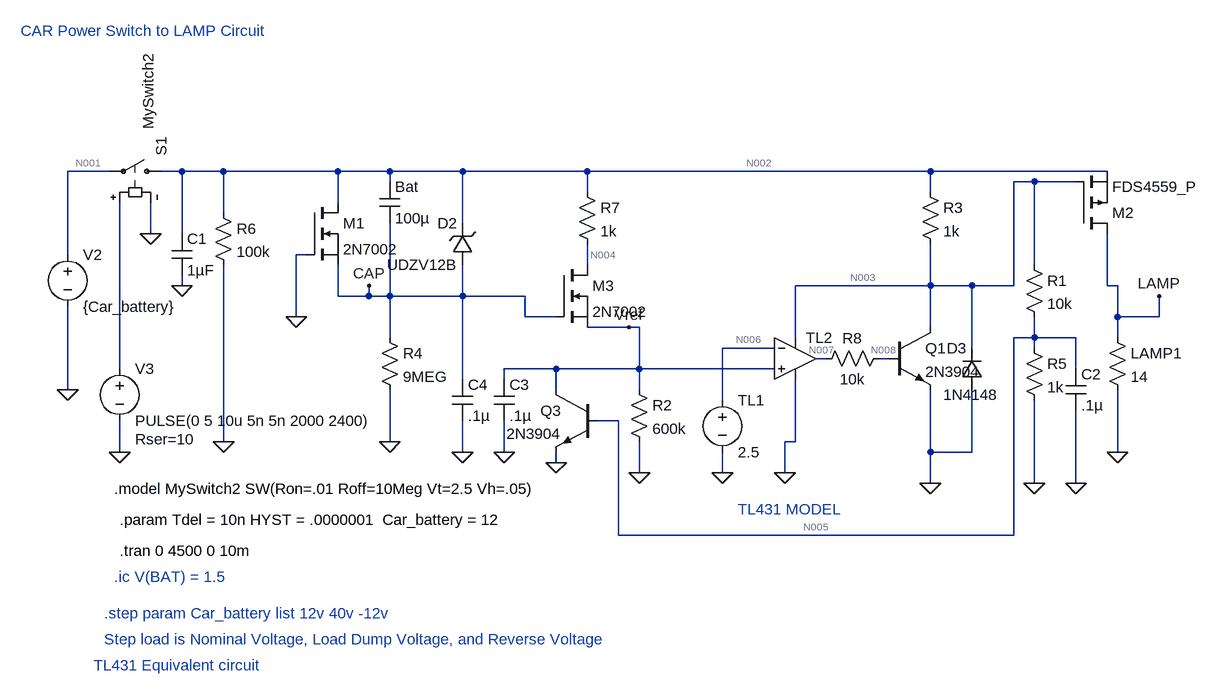
[diagram p0: schematic BMW_E36_TrunkLightHack.asc]
BMW_E36_TrunkLightHack.asc, the LTspice schematic file:
Version 4
SHEET 1 2124 768
WIRE -64 -160 -128 -160
WIRE 48 -160 16 -160
WIRE 112 -160 48 -160
WIRE 288 -160 112 -160
WIRE 368 -160 288 -160
WIRE 480 -160 368 -160
WIRE 672 -160 480 -160
WIRE 1200 -160 672 -160
WIRE 1472 -160 1200 -160
WIRE 368 -144 368 -160
WIRE 1360 -144 1328 -144
WIRE 1424 -144 1360 -144
WIRE 672 -128 672 -160
WIRE 1200 -128 1200 -160
WIRE 288 -112 288 -160
WIRE 112 -96 112 -160
WIRE 480 -80 480 -160
WIRE 0 -64 0 -112
WIRE 48 -64 48 -160
WIRE -128 -32 -128 -160
WIRE 240 -32 224 -32
WIRE 672 -16 672 -48
WIRE 1360 -16 1360 -144
WIRE 48 16 48 0
WIRE 1200 16 1200 -48
WIRE 1200 16 992 16
WIRE 1264 16 1200 16
WIRE 1328 16 1328 -144
WIRE 1328 16 1264 16
WIRE 1472 16 1472 -64
WIRE 1488 16 1472 16
WIRE 288 32 288 -16
WIRE 336 32 336 16
WIRE 336 32 288 32
WIRE 368 32 368 -80
WIRE 368 32 336 32
WIRE 480 32 480 -16
WIRE 480 32 368 32
WIRE 576 32 480 32
WIRE 224 64 224 -32
WIRE 576 64 576 32
WIRE 624 64 576 64
WIRE 1488 64 1488 16
WIRE 1552 64 1552 32
WIRE 1552 64 1488 64
WIRE 736 80 672 80
WIRE 752 80 736 80
WIRE 1200 80 1200 16
WIRE 368 96 368 32
WIRE 992 96 992 16
WIRE 1360 96 1360 64
WIRE 1360 96 1328 96
WIRE 1424 96 1360 96
WIRE 1488 96 1488 64
WIRE 960 112 880 112
WIRE 1264 112 1264 16
WIRE 1360 112 1360 96
WIRE 1040 128 1024 128
WIRE 1136 128 1120 128
WIRE -48 144 -48 -112
WIRE 624 144 544 144
WIRE 752 144 752 80
WIRE 752 144 624 144
WIRE 960 144 752 144
WIRE 1424 144 1424 96
WIRE 480 160 480 32
WIRE 544 160 544 144
WIRE -128 176 -128 48
WIRE 624 176 624 144
WIRE 752 176 752 144
WIRE 880 192 880 112
WIRE 720 224 688 224
WIRE 112 256 112 -16
WIRE 368 256 368 176
WIRE 992 256 992 160
WIRE 992 256 976 256
WIRE -48 272 -48 224
WIRE 480 272 480 224
WIRE 544 272 544 224
WIRE 1200 272 1200 176
WIRE 1264 272 1264 176
WIRE 1264 272 1200 272
WIRE 1488 272 1488 176
WIRE 624 288 624 272
WIRE 752 304 752 256
WIRE 880 304 880 272
WIRE 976 304 976 256
WIRE 1200 320 1200 272
WIRE 1360 320 1360 192
WIRE 1424 320 1424 208
WIRE 720 400 720 224
WIRE 1328 400 1328 96
WIRE 1328 400 720 400
FLAG 368 256 0
FLAG -128 176 0
FLAG 112 256 0
FLAG 0 -64 0
FLAG -48 272 0
FLAG 1488 272 0
FLAG 1200 320 0
FLAG 880 304 0
FLAG 752 304 0
FLAG 976 304 0
FLAG 224 64 0
FLAG 736 80 Vref
FLAG 1552 32 LAMP
FLAG 336 16 CAP
FLAG 48 16 0
FLAG 624 288 0
FLAG 1360 320 0
FLAG 1424 320 0
FLAG 544 272 0
FLAG 480 272 0
SYMBOL res 1184 -144 R0
SYMATTR InstName R3
SYMATTR Value 1k
SYMBOL res 352 80 R0
SYMATTR InstName R4
SYMATTR Value 9MEG
SYMBOL cap 352 -144 R0
SYMATTR InstName Bat
SYMATTR Value 100µ
SYMBOL voltage -128 -48 R0
WINDOW 123 0 0 Left 2
WINDOW 39 0 0 Left 2
SYMATTR InstName V2
SYMATTR Value {Car_battery}
SYMBOL voltage -48 128 R0
WINDOW 123 0 0 Left 2
WINDOW 39 24 124 Left 2
SYMATTR SpiceLine Rser=10
SYMATTR InstName V3
SYMATTR Value PULSE(0 5 10u 5n 5n 2000 2400)
SYMBOL res 96 -112 R0
SYMATTR InstName R6
SYMATTR Value 100k
SYMBOL sw 32 -160 M270
WINDOW 3 65 36 Left 2
SYMATTR Value MySwitch2
SYMATTR InstName S1
SYMBOL pmos 1424 -64 M180
SYMATTR InstName M2
SYMATTR Value FDS4559_P
SYMBOL res 1472 80 R0
SYMATTR InstName LAMP1
SYMATTR Value 14
SYMBOL npn 1136 80 R0
SYMATTR InstName Q1
SYMATTR Value 2N3904
SYMBOL voltage 880 176 R0
WINDOW 123 0 0 Left 2
WINDOW 39 0 0 Left 2
SYMATTR InstName TL1
SYMATTR Value 2.5
SYMBOL res 736 160 R0
SYMATTR InstName R2
SYMATTR Value 600k
SYMBOL res 1136 112 R90
WINDOW 0 0 56 VBottom 2
WINDOW 3 32 56 VTop 2
SYMATTR InstName R8
SYMATTR Value 10k
SYMBOL Opamps\\UniversalOpamp2 992 128 R0
SYMATTR InstName TL2
SYMATTR Value2 Avol=1Meg GBW=0.1Meg Slew=1Meg
SYMBOL diode 1280 176 R180
WINDOW 0 24 64 Left 2
WINDOW 3 -25 -8 Left 2
SYMATTR InstName D3
SYMATTR Value 1N4148
SYMBOL npn 688 176 M0
SYMATTR InstName Q3
SYMATTR Value 2N3904
SYMBOL nmos 240 -112 R0
SYMATTR InstName M1
SYMATTR Value 2N7002
SYMBOL zener 496 -16 R180
WINDOW 0 24 64 Left 2
WINDOW 3 24 0 Left 2
SYMATTR InstName D2
SYMATTR Value UDZV12B
SYMATTR Description Diode
SYMATTR Type diode
SYMBOL cap 32 -64 R0
SYMATTR InstName C1
SYMATTR Value 1µF
SYMBOL res 1344 -32 R0
SYMATTR InstName R1
SYMATTR Value 10k
SYMBOL res 1344 96 R0
SYMATTR InstName R5
SYMATTR Value 1k
SYMBOL cap 1408 144 R0
SYMATTR InstName C2
SYMATTR Value .1µ
SYMBOL nmos 624 -16 R0
SYMATTR InstName M3
SYMATTR Value 2N7002
SYMBOL res 656 -144 R0
SYMATTR InstName R7
SYMATTR Value 1k
SYMBOL cap 528 160 R0
SYMATTR InstName C3
SYMATTR Value .1µ
SYMBOL cap 464 160 R0
SYMATTR InstName C4
SYMATTR Value .1µ
TEXT -48 376 Left 2 !.param Tdel = 10n HYST = .0000001  Car_battery = 12
TEXT -56 328 Left 2 !.model MySwitch2 SW(Ron=.01 Roff=10Meg Vt=2.5 Vh=.05)
TEXT -48 424 Left 2 !.tran 0 4500 0 10m
TEXT -88 600 Left 2 ;TL431 Equivalent circuit
TEXT -72 520 Left 2 ;.step param Car_battery list 12v 40v -12v
TEXT -72 560 Left 2 ;Step load is Nominal Voltage, Load Dump Voltage, and Reverse Voltage
TEXT -56 464 Left 2 ;.ic V(BAT) = 1.5
TEXT 904 360 Left 2 ;TL431 MODEL
TEXT -200 -376 Left 2 ;CAR Power Switch to LAMP Circuit

The netlist it stands for:
* BMW_E36_TrunkLightHack.asc
R3 N002 N003 1k
R4 CAP 0 9MEG
C§Bat N002 CAP 100µ
V2 N001 0 {Car_battery}
V3 N009 0 PULSE(0 5 10u 5n 5n 2000 2400) Rser=10
R6 N002 0 100k
S1 N002 N001 N009 0 MySwitch2
M2 LAMP N003 N002 N002 FDS4559_P
R§LAMP1 LAMP 0 14
Q1 N003 N008 0 0 2N3904
V§TL1 N006 0 2.5
R2 Vref 0 600k
R8 N008 N007 10k
XTL2 Vref N006 N003 0 N007 level.2 Avol=1Meg GBW=0.1Meg Slew=1Meg ilimit=25m rail=0 Vos=0 phimargin=45 en=0 enk=0 in=0 ink=0 Rin=500Meg  ; pins IN+ IN- V+ V- OUT
D3 0 N003 1N4148
Q3 Vref N005 0 0 2N3904
M1 N002 0 CAP CAP 2N7002
D2 CAP N002 UDZV12B
C1 N002 0 1µF
R1 N003 N005 10k
R5 N005 0 1k
C2 N005 0 .1µ
M3 N004 CAP Vref Vref 2N7002
R7 N002 N004 1k
C3 Vref 0 .1µ
C4 CAP 0 .1µ
.model D D
.lib standard.dio
.model NPN NPN
.model PNP PNP
.lib standard.bjt
.model NMOS NMOS
.model PMOS PMOS
.lib standard.mos
.param Tdel = 10n HYST = .0000001  Car_battery = 12
.model MySwitch2 SW(Ron=.01 Roff=10Meg Vt=2.5 Vh=.05)
.tran 0 4500 0 10m
* TL431 Equivalent circuit
* .step param Car_battery list 12v 40v -12v
* Step load is Nominal Voltage, Load Dump Voltage, and Reverse Voltage
* .ic V(BAT) = 1.5
* TL431 MODEL
* CAR Power Switch to LAMP Circuit
.lib UniversalOpamps2.sub
.backanno
.end

* Results of the author's LTspice run, read from the files saved beside the schematic
* Operating Point, zero values left out:
*   V(n002) = 12.62 mV
*   V(n003) = 11.55 mV
*   V(cap) = 1.569 µV
*   V(n001) = 12 V
*   V(n008) = 14.12 nV
*   V(n006) = 2.5 V
*   V(vref) = 6.948 µV
*   V(n007) = 13.99 nV
*   V(n005) = 1.05 mV
*   V(n004) = 12.62 mV
*   Id(M2) = -11.6 pA
*   Is(M2) = 11.6 pA
*   I(D3) = -567.1 pA
*   I(R5) = 1.05 µA
*   I(R1) = 1.05 µA
*   I(R2) = 11.58 pA
*   I(Lamp1) = 11.61 pA
*   I(R6) = 126.2 nA
*   I(R3) = 1.072 µA
*   I(S1) = 1.199 µA
*   I(Tl1) = -4.988 nA
*   I(V2) = -1.199 µA
*   Ix(tl2:1) = -11.54 pA
*   Ix(tl2:2) = 4.988 nA
*   Ix(tl2:3) = 21.78 nA
*   Ix(tl2:4) = 19.16 nA
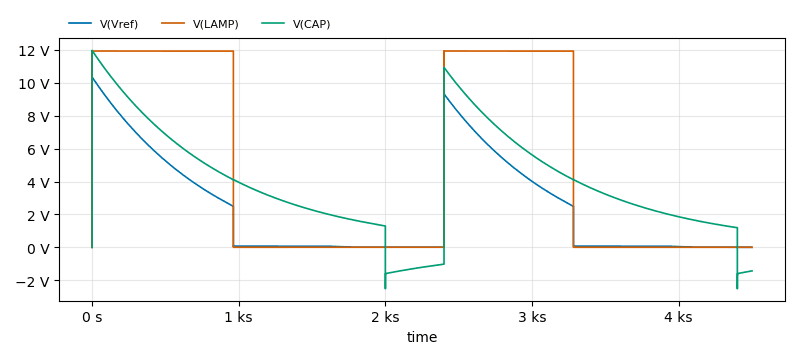
[diagram p1: Transient Analysis of BMW_E36_TrunkLightHack.asc, plotted from the saved traces]
* Transient Analysis, 1 run:
*   V(Vref): min 6.948 µV, max 10.35 V, average 2.304 V, rms 3.811 V, last 7.94 µV
*   V(LAMP): min -3.54 mV, max 11.94 V, average 4.896 V, rms 7.644 V, last 0 V
*   V(CAP): min -2.525 V, max 11.98 V, average 3.941 V, rms 5.12 V, last -1.434 V